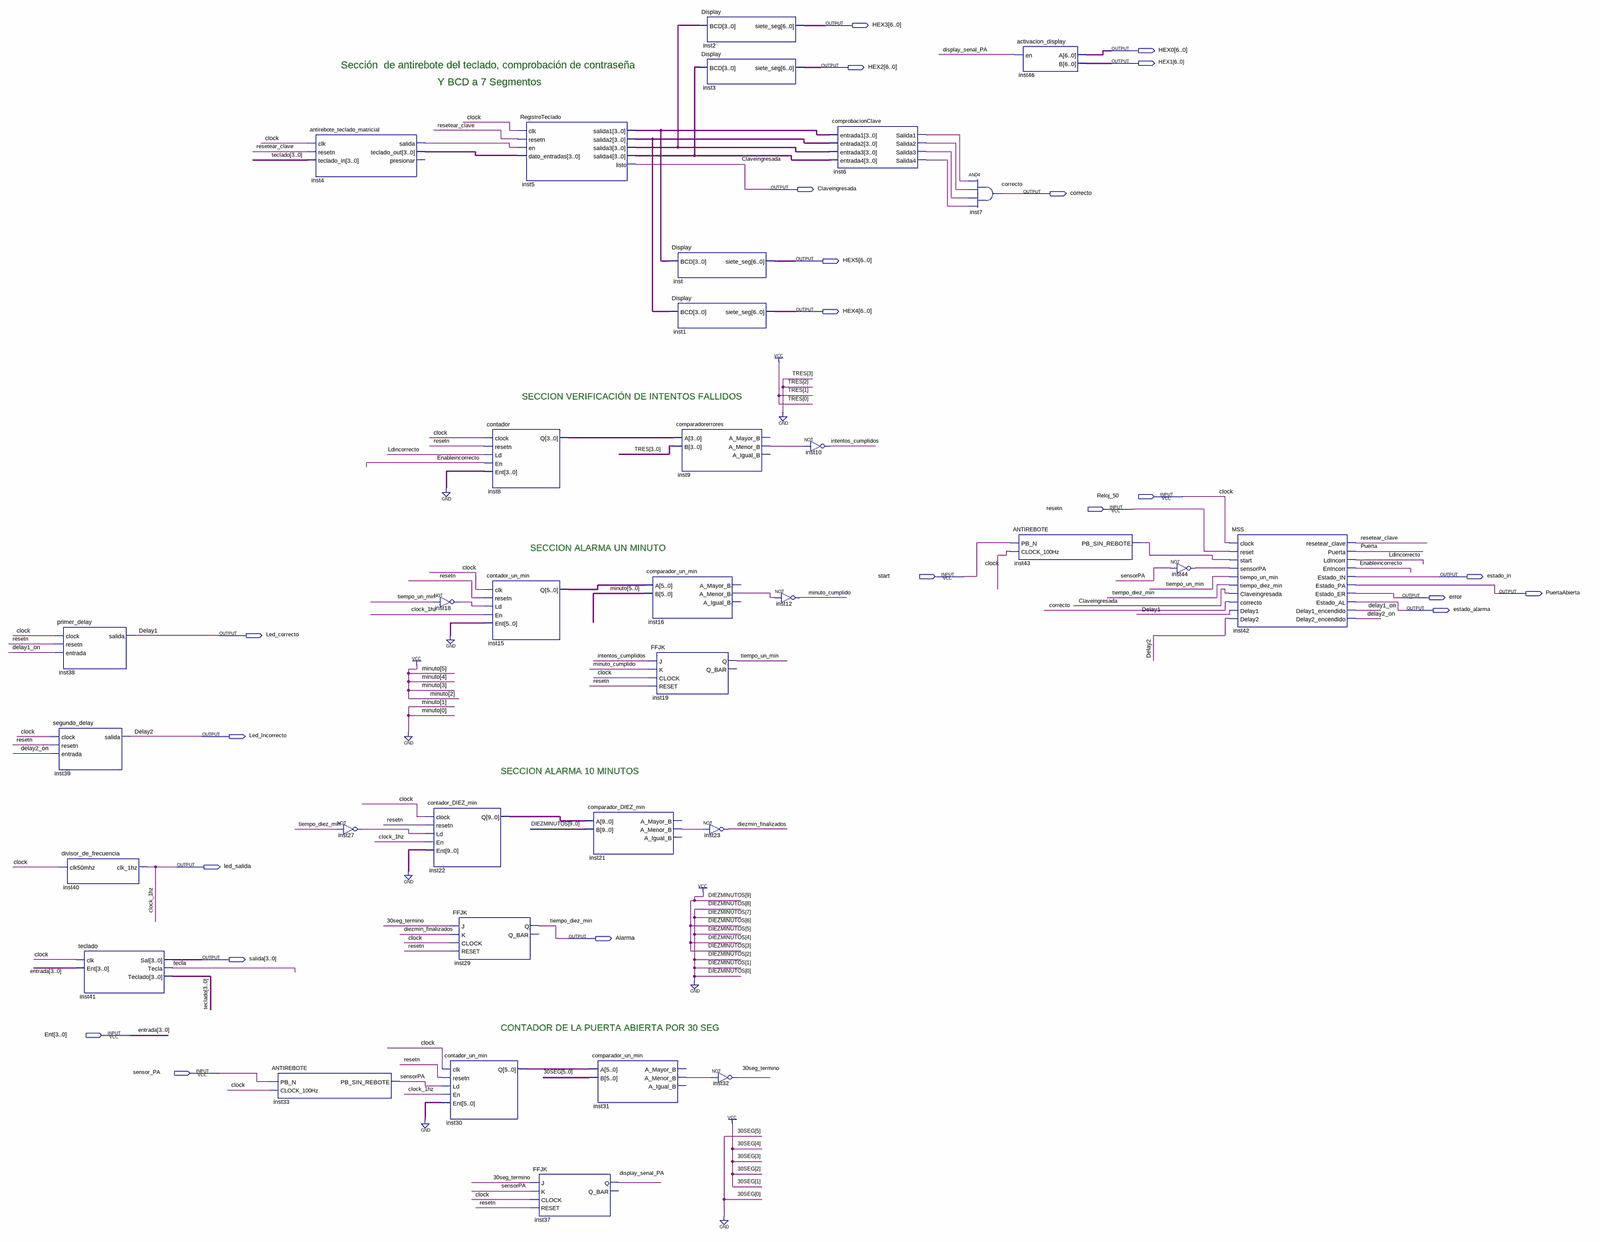
[diagram p0: schematic sheet, whole]
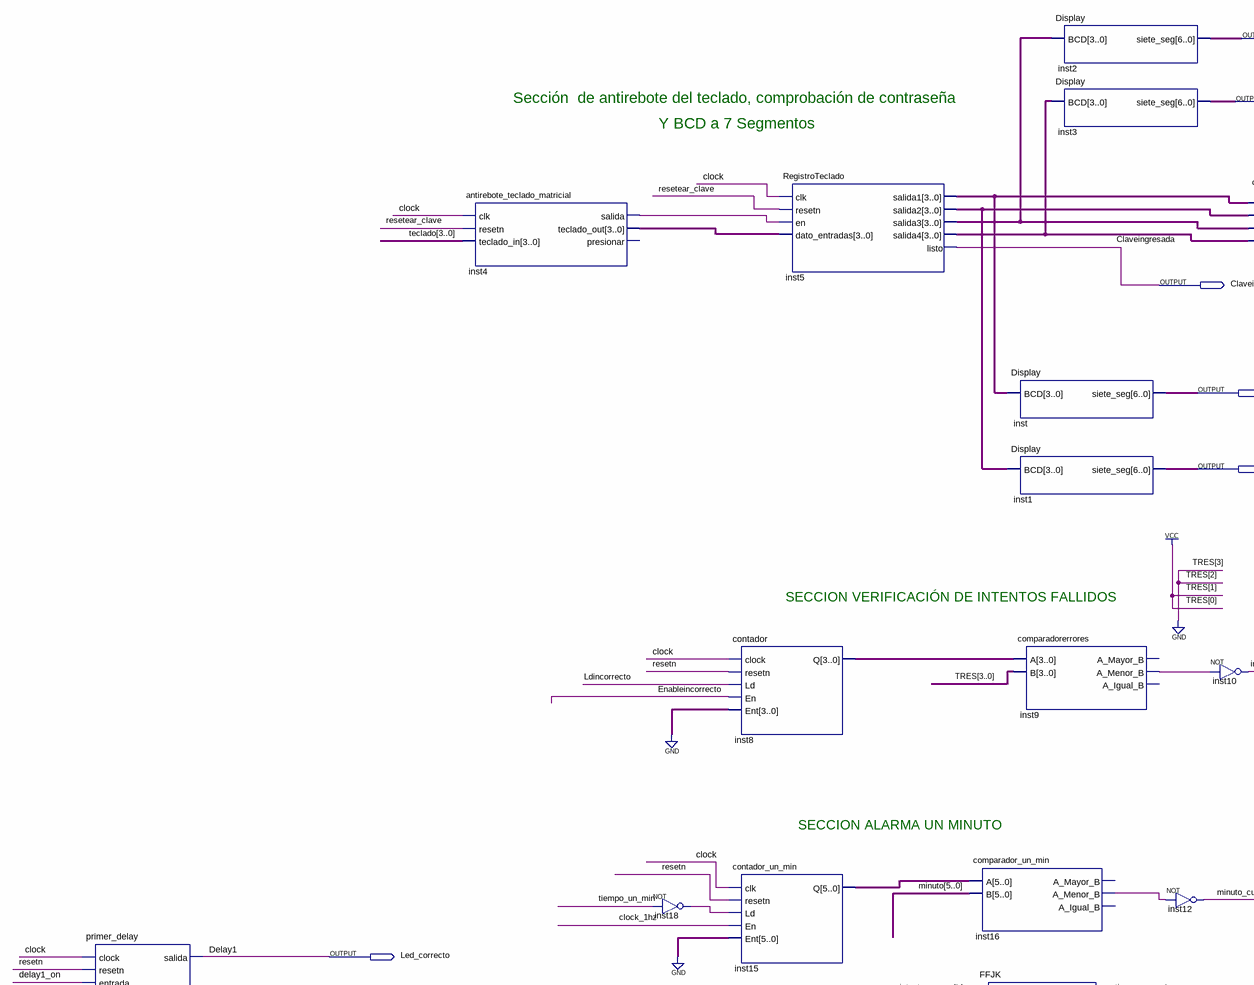
[diagram p1: schematic sheet, upper left part]
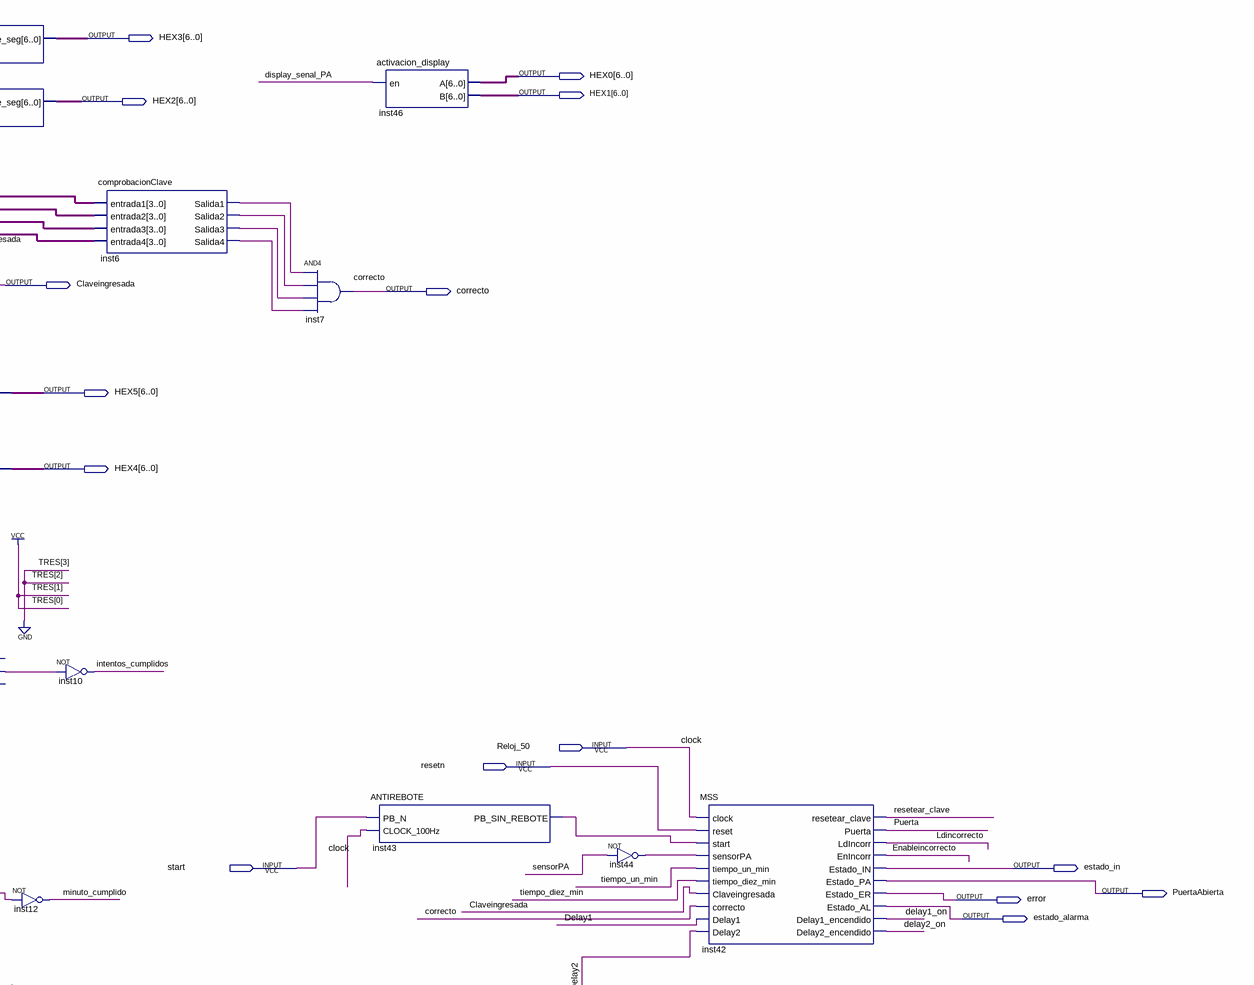
[diagram p2: schematic sheet, upper right part]
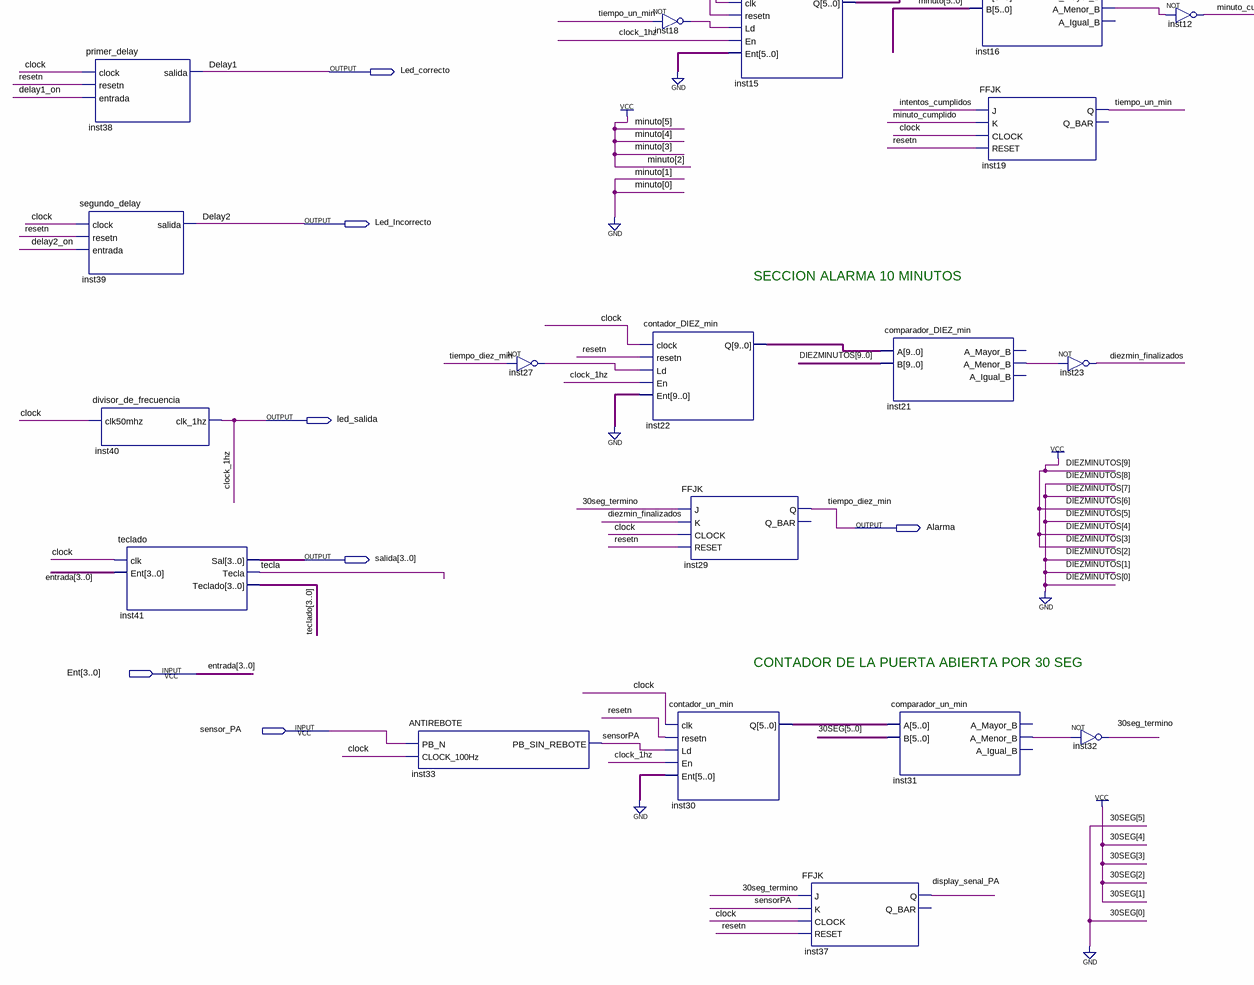
[diagram p3: schematic sheet, lower left part]
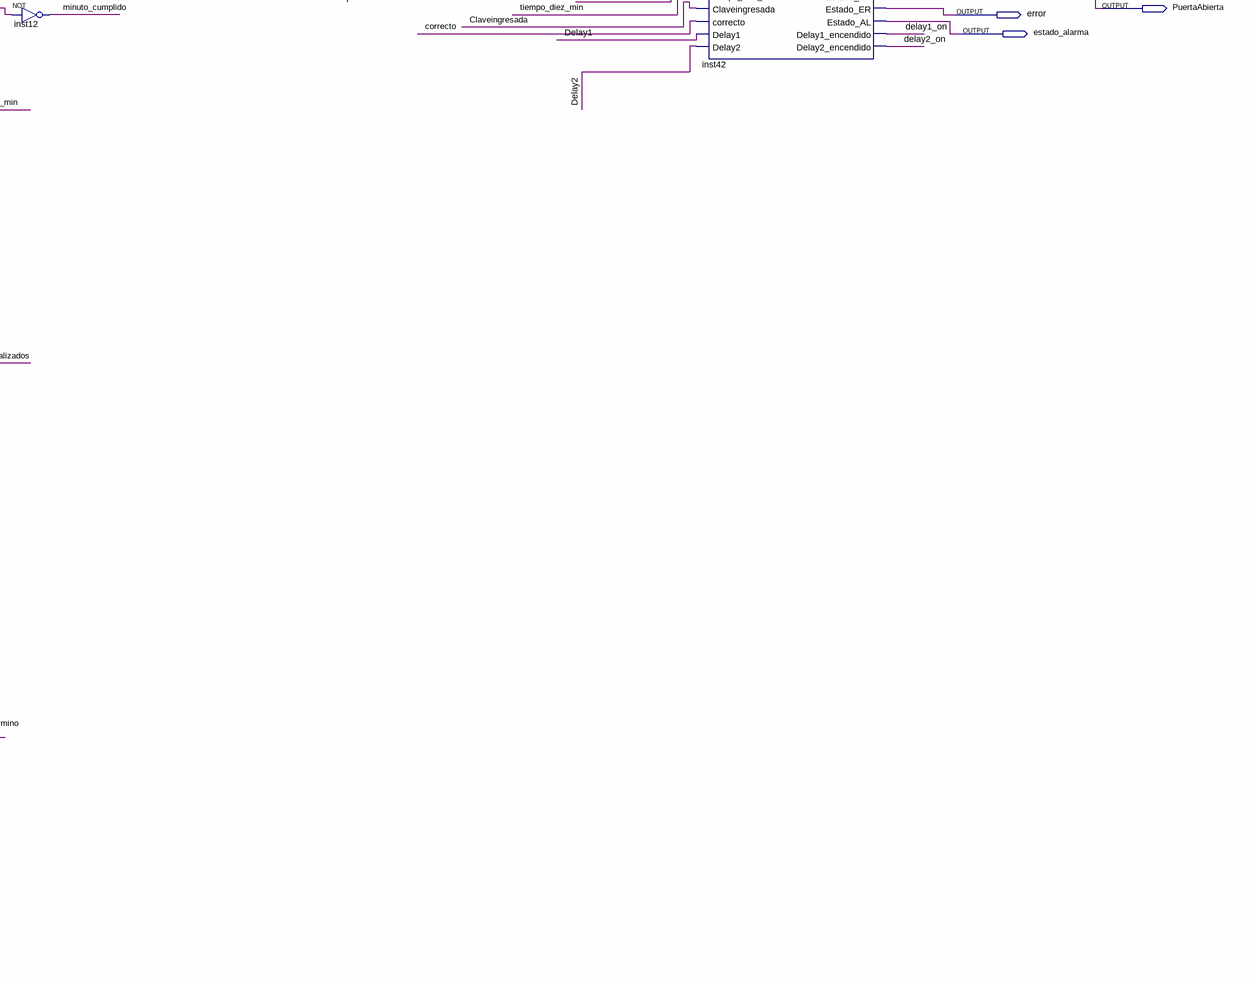
[diagram p4: schematic sheet, lower right part]
// Quartus schematic ParticionFuncional.bdf as structural Verilog: 34 symbols, 22 pins
module ParticionFuncional (
  input  Reloj_50,
  input  resetn,
  input  start,
  input  [3:0] Ent,
  input  sensor_PA,
  output [6:0] HEX3,
  output [6:0] HEX0,
  output [6:0] HEX1,
  output [6:0] HEX2,
  output Claveingresada,
  output correcto,
  output [6:0] HEX5,
  output [6:0] HEX4,
  output estado_in,
  output PuertaAbierta,
  output error,
  output estado_alarma,
  output Led_correcto,
  output Led_Incorrecto,
  output led_salida,
  output Alarma,
  output [3:0] salida
);

  wire \30seg_termino , delay1_on, delay2_on, diezmin_finalizados, display_senal_PA, Enableincorrecto,
       inst4_salida, inst6_salida1, inst6_salida2, inst6_salida3, inst6_salida4, inst9_a_menor_b,
       inst16_a_menor_b, inst18_out, inst21_a_menor_b, inst27_out, inst31_a_menor_b, inst43_pb_sin_rebote,
       inst44_out, intentos_cumplidos, Ldincorrecto, minuto_cumplido, Puerta, resetear_clave, sensorPA,
       tecla, tiempo_un_min;
  wire [3:0] inst4_teclado_out, inst5_salida1, inst5_salida2, inst5_salida3, inst5_salida4, inst8_q, teclado;
  wire [5:0] inst15_q, inst30_q;
  wire [9:0] inst22_q;

  primer_delay inst38 (.clock(Reloj_50), .resetn(resetn), .entrada(delay1_on), .salida(Led_correcto));
  segundo_delay inst39 (.clock(Reloj_50), .resetn(resetn), .entrada(delay2_on), .salida(Led_Incorrecto));
  divisor_de_frecuencia inst40 (.clk50mhz(Reloj_50), .clk_1hz(led_salida));
  teclado inst41 (.clk(Reloj_50), .Ent(Ent), .Sal(salida), .Tecla(tecla), .Teclado(teclado));
  ANTIREBOTE inst33 (.PB_N(sensor_PA), .CLOCK_100Hz(Reloj_50), .PB_SIN_REBOTE(sensorPA));
  antirebote_teclado_matricial inst4 (
    .clk(Reloj_50), .resetn(resetear_clave), .teclado_in(teclado), .salida(inst4_salida),
    .teclado_out(inst4_teclado_out));  // open: presionar
  not inst27 (inst27_out, Alarma);
  not inst18 (inst18_out, tiempo_un_min);
  contador_DIEZ_min inst22 (
    .clock(Reloj_50), .resetn(resetn), .Ld(inst27_out), .En(led_salida), .Ent({10{1'b0}}), .Q(inst22_q));
  FFJK inst29 (
    .J(\30seg_termino ), .K(diezmin_finalizados), .CLOCK(Reloj_50), .RESET(resetn), .Q(Alarma));  // open: Q_BAR
  contador_un_min inst30 (
    .clk(Reloj_50), .resetn(resetn), .Ld(sensorPA), .En(led_salida), .Ent({6{1'b0}}), .Q(inst30_q));
  contador inst8 (
    .clock(Reloj_50), .resetn(resetn), .Ld(Ldincorrecto), .En(Enableincorrecto), .Ent(4'b0000), .Q(inst8_q));
  contador_un_min inst15 (
    .clk(Reloj_50), .resetn(resetn), .Ld(inst18_out), .En(led_salida), .Ent({6{1'b0}}), .Q(inst15_q));
  RegistroTeclado inst5 (
    .clk(Reloj_50), .resetn(resetear_clave), .en(inst4_salida), .dato_entradas(inst4_teclado_out),
    .salida1(inst5_salida1), .salida2(inst5_salida2), .salida3(inst5_salida3), .salida4(inst5_salida4),
    .listo(Claveingresada));
  FFJK inst37 (
    .J(\30seg_termino ), .K(sensorPA), .CLOCK(Reloj_50), .RESET(resetn), .Q(display_senal_PA));  // open: Q_BAR
  comparador_DIEZ_min inst21 (
    .A(inst22_q), .B(10'b1001011000), .A_Menor_B(inst21_a_menor_b));  // open: A_Mayor_B, A_Igual_B
  comparador_un_min inst31 (.A(inst30_q), .B(6'b011110), .A_Menor_B(inst31_a_menor_b));  // open: A_Mayor_B, A_Igual_B
  Display inst (.BCD(inst5_salida1), .siete_seg(HEX5));
  Display inst1 (.BCD(inst5_salida2), .siete_seg(HEX4));
  comparadorerrores inst9 (.A(inst8_q), .B(4'b0011), .A_Menor_B(inst9_a_menor_b));  // open: A_Mayor_B, A_Igual_B
  comparador_un_min inst16 (.A(inst15_q), .B(6'b111100), .A_Menor_B(inst16_a_menor_b));  // open: A_Mayor_B, A_Igual_B
  FFJK inst19 (
    .J(intentos_cumplidos), .K(minuto_cumplido), .CLOCK(Reloj_50), .RESET(resetn), .Q(tiempo_un_min));  // open: Q_BAR
  Display inst2 (.BCD(inst5_salida3), .siete_seg(HEX3));
  Display inst3 (.BCD(inst5_salida4), .siete_seg(HEX2));
  not inst23 (diezmin_finalizados, inst21_a_menor_b);
  not inst32 (\30seg_termino , inst31_a_menor_b);
  not inst12 (minuto_cumplido, inst16_a_menor_b);
  not inst10 (intentos_cumplidos, inst9_a_menor_b);
  comprobacionClave inst6 (
    .entrada1(inst5_salida1), .entrada2(inst5_salida2), .entrada3(inst5_salida3), .entrada4(inst5_salida4),
    .Salida1(inst6_salida1), .Salida2(inst6_salida2), .Salida3(inst6_salida3), .Salida4(inst6_salida4));
  and inst7 (correcto, inst6_salida1, inst6_salida2, inst6_salida3, inst6_salida4);
  ANTIREBOTE inst43 (.PB_N(start), .CLOCK_100Hz(Reloj_50), .PB_SIN_REBOTE(inst43_pb_sin_rebote));
  activacion_display inst46 (.en(display_senal_PA), .A(HEX0), .B(HEX1));
  not inst44 (inst44_out, sensorPA);
  MSS inst42 (
    .clock(Reloj_50), .reset(resetn), .start(inst43_pb_sin_rebote), .sensorPA(inst44_out),
    .tiempo_un_min(tiempo_un_min), .tiempo_diez_min(Alarma), .Claveingresada(Claveingresada),
    .correcto(correcto), .Delay1(Led_correcto), .Delay2(Led_Incorrecto), .resetear_clave(resetear_clave),
    .Puerta(Puerta), .LdIncorr(Ldincorrecto), .EnIncorr(Enableincorrecto), .Estado_IN(estado_in),
    .Estado_PA(PuertaAbierta), .Estado_ER(error), .Estado_AL(estado_alarma), .Delay1_encendido(delay1_on),
    .Delay2_encendido(delay2_on));

  // Other names for the same wires on the sheet: tiempo_diez_min = Alarma; clock = Reloj_50; clock_1hz = led_salida;
  //   Delay1 = Led_correcto; Delay2 = Led_Incorrecto; entrada[3:0] = Ent

  // Notes on the sheet:
  //   Sección  de antirebote del teclado, comprobación de contraseña
  //   Y BCD a 7 Segmentos
  //   SECCION VERIFICACIÓN DE INTENTOS FALLIDOS
  //   SECCION ALARMA UN MINUTO
  //   SECCION ALARMA 10 MINUTOS
  //   CONTADOR DE LA PUERTA ABIERTA POR 30 SEG
endmodule
